# EAGLE design schematic_mod (EAGLE 7.3.0)
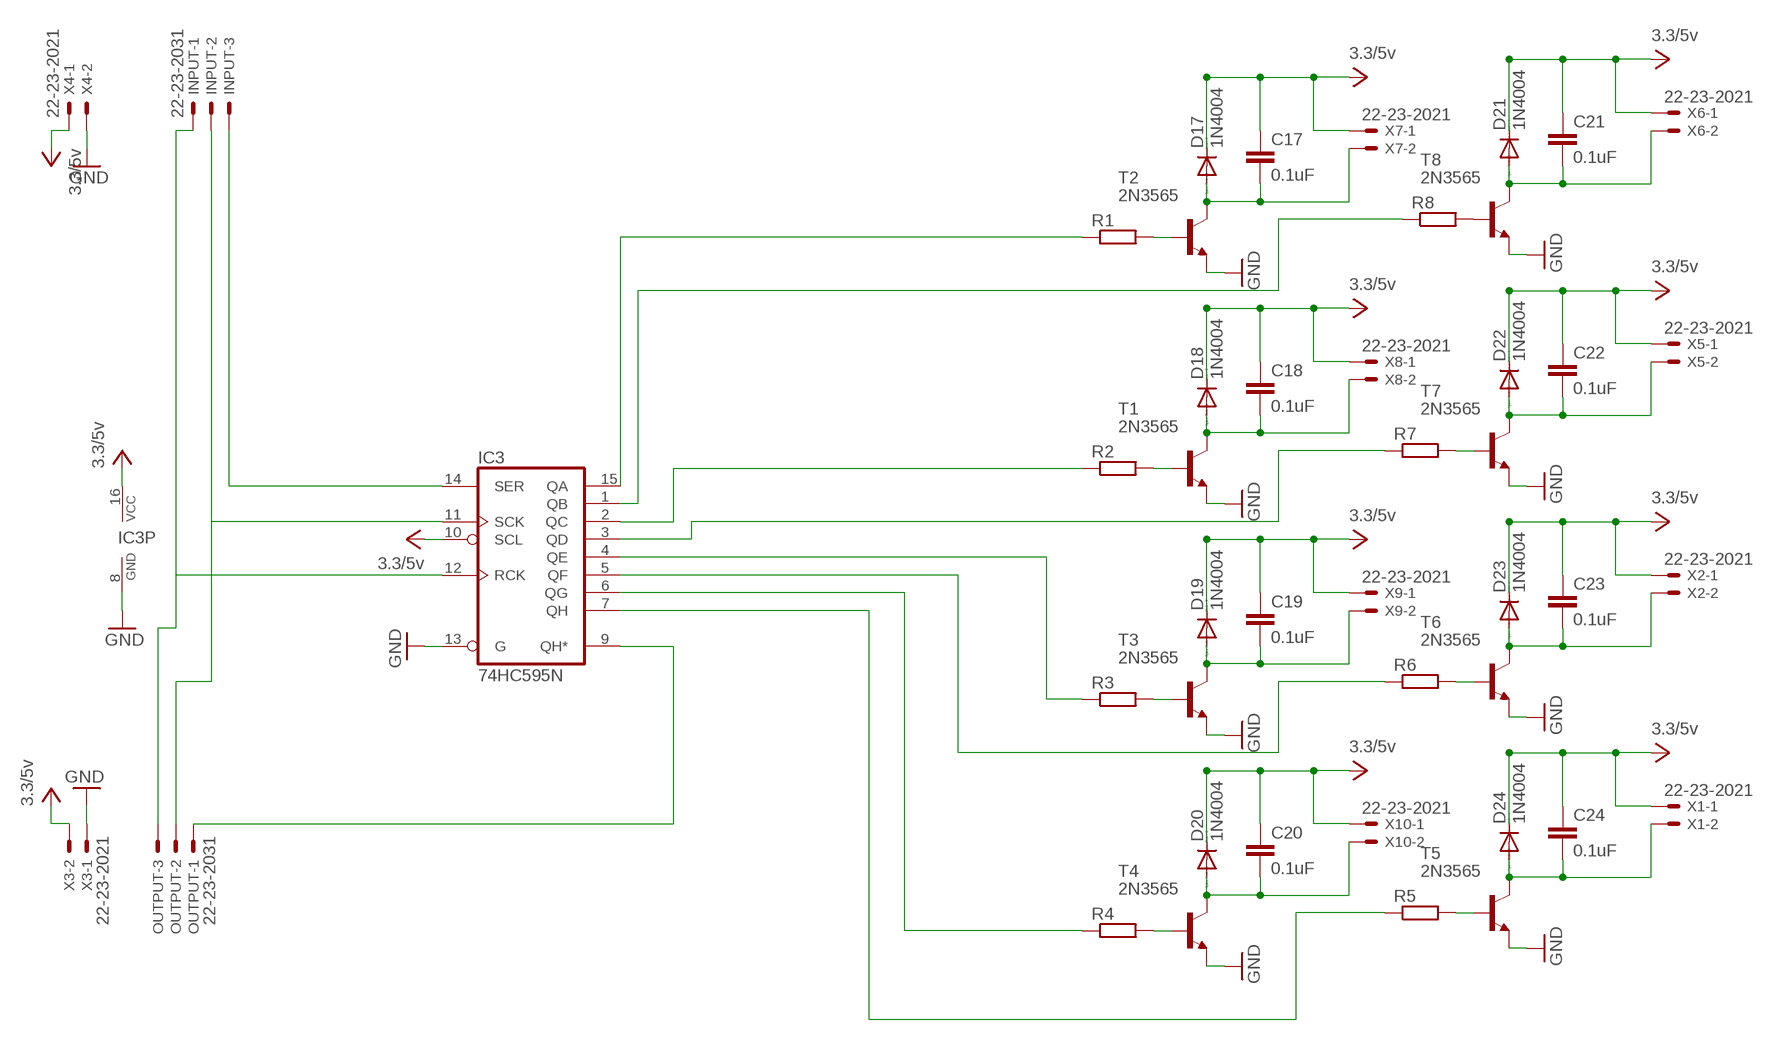
[diagram p0: schematic, sheet 1]

## Parts
C17  0.1uF  C-EU025-024X044  [C025-024X044]
C18  0.1uF  C-EU025-024X044  [C025-024X044]
C19  0.1uF  C-EU025-024X044  [C025-024X044]
C20  0.1uF  C-EU025-024X044  [C025-024X044]
C21  0.1uF  C-EU025-024X044  [C025-024X044]
C22  0.1uF  C-EU025-024X044  [C025-024X044]
C23  0.1uF  C-EU025-024X044  [C025-024X044]
C24  0.1uF  C-EU025-024X044  [C025-024X044]
D17  1N4004  [DO41-10]
D18  1N4004  [DO41-10]
D19  1N4004  [DO41-10]
D20  1N4004  [DO41-10]
D21  1N4004  [DO41-10]
D22  1N4004  [DO41-10]
D23  1N4004  [DO41-10]
D24  1N4004  [DO41-10]
IC3  74HC595N  [DIL16]
INPUT  22-23-2031  [22-23-2031]
OUTPUT  22-23-2031  [22-23-2031]
R1  R-EU_0207/7  [0207/7]
R2  R-EU_0207/7  [0207/7]
R3  R-EU_0207/7  [0207/7]
R4  R-EU_0207/7  [0207/7]
R5  R-EU_0207/7  [0207/7]
R6  R-EU_0207/7  [0207/7]
R7  R-EU_0207/7  [0207/7]
R8  R-EU_0207/7  [0207/7]
T1  2N3565  [TO92]
T2  2N3565  [TO92]
T3  2N3565  [TO92]
T4  2N3565  [TO92]
T5  2N3565  [TO92]
T6  2N3565  [TO92]
T7  2N3565  [TO92]
T8  2N3565  [TO92]
X1  22-23-2021  [22-23-2021]
X2  22-23-2021  [22-23-2021]
X3  22-23-2021  [22-23-2021]
X4  22-23-2021  [22-23-2021]
X5  22-23-2021  [22-23-2021]
X6  22-23-2021  [22-23-2021]
X7  22-23-2021  [22-23-2021]
X8  22-23-2021  [22-23-2021]
X9  22-23-2021  [22-23-2021]
X10  22-23-2021  [22-23-2021]

## Nets
GND: IC3.8(GND) IC3.13(G) T1.3(E) T2.3(E) T3.3(E) T4.3(E) T5.3(E) T6.3(E) T7.3(E) T8.3(E) X3.1 X4.2
N$1: R8.2 T8.2(B)
N$54: C17.2 D17.A T2.1(C) X7.2
N$55: R1.2 T2.2(B)
N$57: C18.2 D18.A T1.1(C) X8.2
N$58: R2.2 T1.2(B)
N$59: C19.2 D19.A T3.1(C) X9.2
N$60: R3.2 T3.2(B)
N$61: C20.2 D20.A T4.1(C) X10.2
N$62: R4.2 T4.2(B)
N$63: C21.2 D21.A T8.1(C) X6.2
N$65: C22.2 D22.A T7.1(C) X5.2
N$66: R7.2 T7.2(B)
N$67: C23.2 D23.A T6.1(C) X2.2
N$68: R6.2 T6.2(B)
N$69: C24.2 D24.A T5.1(C) X1.2
N$70: R5.2 T5.2(B)
N$71: IC3.15(QA) R1.1
N$72: IC3.1(QB) R8.1
N$73: IC3.2(QC) R2.1
N$74: IC3.3(QD) R7.1
N$75: IC3.4(QE) R3.1
N$76: IC3.5(QF) R6.1
N$77: IC3.6(QG) R4.1
N$78: IC3.7(QH) R5.1
N$79: IC3.14(SER) INPUT.3
N$106: IC3.9(QH*) OUTPUT.1
N$180: IC3.11(SCK) INPUT.2 OUTPUT.2
N$181: IC3.12(RCK) INPUT.1 OUTPUT.3
VCC: C17.1 C18.1 C19.1 C20.1 C21.1 C22.1 C23.1 C24.1 D17.C D18.C D19.C D20.C D21.C D22.C D23.C D24.C IC3.10(SCL) IC3.16(VCC) X1.1 X2.1 X3.2 X4.1 X5.1 X6.1 X7.1 X8.1 X9.1 X10.1 ; supply symbol labelled 3.3/5v

## Library data of the parts
C17-C24 = resistor:C-EU: CAPACITOR, European symbol
D17-D24 = diode:1N4004: DIODE general purpose rectifier, 1 A
IC3 = 74xx-eu:74*595: 8-bit SHIFT REGISTER, output latch
INPUT OUTPUT = con-molex:22-23-2031: .100" (2.54mm) Center Header - 3 Pin; MF: MOLEX; MPN: 22-23-2031; OC_FARNELL: 1462950; OC_NEWARK: 30C0862
R1-R8 = rcl:R-EU_: RESISTOR, European symbol
T1-T8 = transistor:2N3565: NPN TRANSISTOR
X1-X10 = con-molex:22-23-2021: .100" (2.54mm) Center Header - 2 Pin; MF: MOLEX; MPN: 22-23-2021; OC_FARNELL: 1462926; OC_NEWARK: 25C3832

## Board
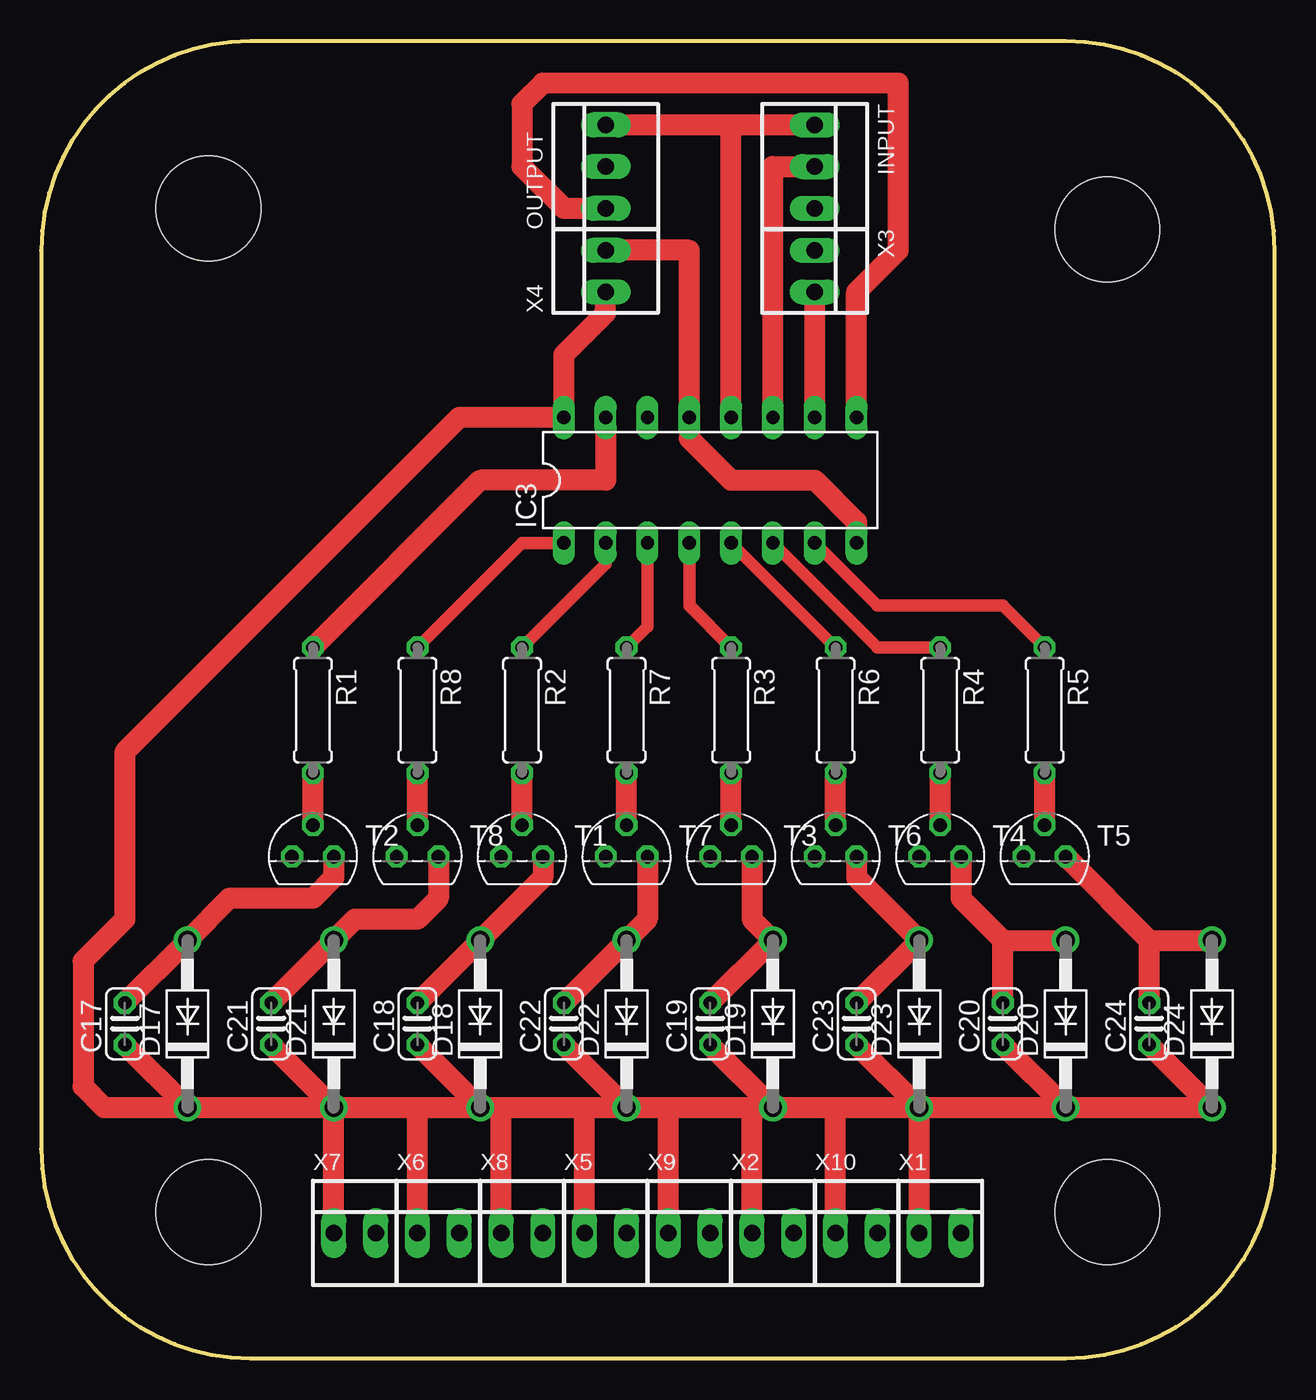
[diagram p1: board, top side]
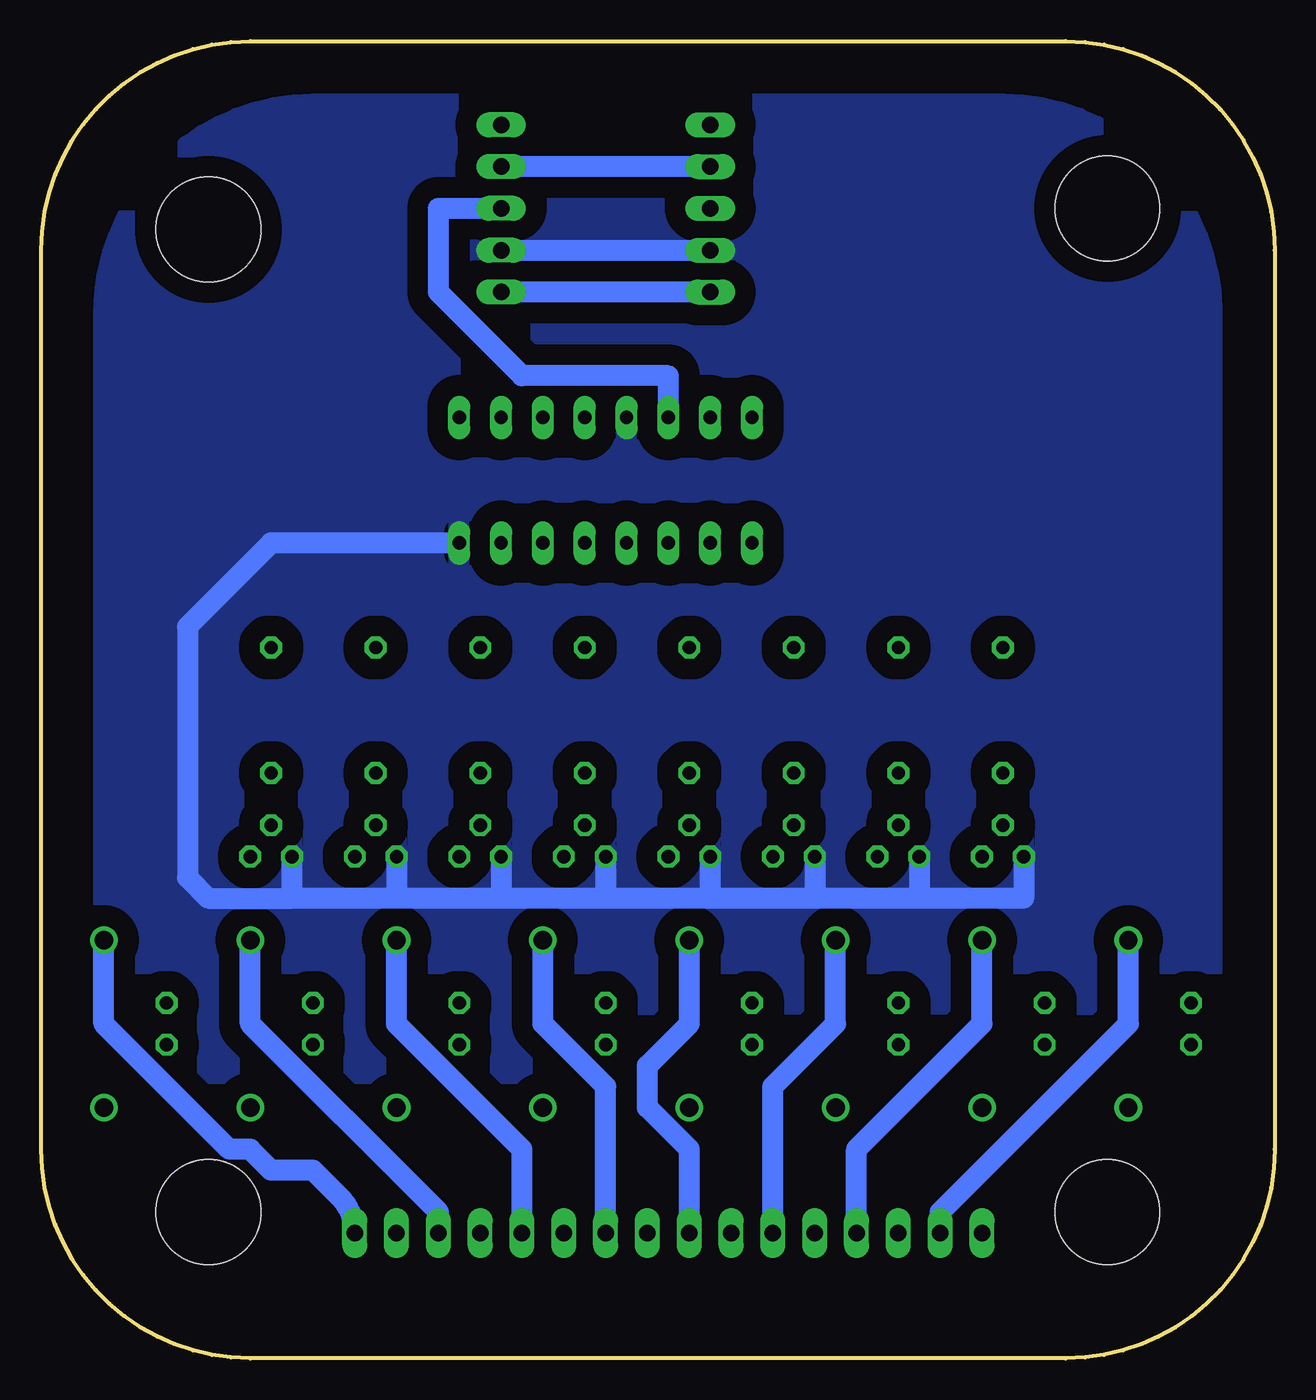
[diagram p2: board, bottom side, seen from below]

Size 74.93 x 80.01 mm. Coordinates in mm from the lower left corner, seen from the top.
Outline: 0,67.31 0,12.7 arc90 12.7,0 62.23,0 arc90 74.93,12.7 74.93,67.31 arc90 62.23,80.01 12.7,80.01 arc90 0,67.31
Copper layers (1*16): Top 0.035mm / dielectric 1.5mm / Bottom 0.035mm
Design rules "default": minimum track width 10mil, minimum drill 24mil, track to track 8mil, track to pad 8mil, pad to pad 8mil, via to via 8mil, smd to smd 8mil, copper to edge 40mil, drill to drill 8mil, minimum pad ring 10mil, minimum via ring 8mil, stop-mask expansion 4mil, vias tented up to drill 0mil, thermal gap 10mil
Holes 6.35 mm at 10.16,69.85 64.77,68.58 10.16,8.89 64.77,8.89

### Footprints (pad centres in the part's own frame; a part is rotated, then mirrored left to right if it is on the bottom)
C025-024X044 = drill 0.813 octagon: 1 -1.27,0; 2 1.27,0
DO41-10 = drill 1.118: A 5.08,0; C -5.08,0
DIL16 = drill 0.813 long: 1 -8.89,-3.81; 2 -6.35,-3.81; 3 -3.81,-3.81; 4 -1.27,-3.81; 5 1.27,-3.81; 6 3.81,-3.81; 7 6.35,-3.81; 8 8.89,-3.81; 9 8.89,3.81; 10 6.35,3.81; 11 3.81,3.81; 12 1.27,3.81; 13 -1.27,3.81; 14 -3.81,3.81; 15 -6.35,3.81; 16 -8.89,3.81
22-23-2031 = drill 1 long: 1 -2.54,0; 2 0,0; 3 2.54,0
0207/7 = drill 0.813 octagon: 1 -3.81,0; 2 3.81,0
TO92 = drill 0.813 octagon: 1 1.27,0; 2 0,1.905; 3 -1.27,0
22-23-2021 = drill 1 long: 1 -1.27,0; 2 1.27,0

### Placement (x,y rotation side)
C17  5.08,20.32 90 top
C18  22.86,20.32 90 top
C19  40.64,20.32 90 top
C20  58.42,20.32 90 top
C21  13.97,20.32 90 top
C22  31.75,20.32 90 top
C23  49.53,20.32 90 top
C24  67.31,20.32 90 top
D17  8.89,20.32 90 top
D18  26.67,20.32 90 top
D19  44.45,20.32 90 top
D20  62.23,20.32 90 top
D21  17.78,20.32 90 top
D22  35.56,20.32 90 top
D23  53.34,20.32 90 top
D24  71.12,20.32 90 top
IC3  40.64,53.34 0 top
INPUT  46.99,72.39 270 top
OUTPUT  34.29,72.39 90 top
R1  16.51,39.37 270 top
R2  29.21,39.37 270 top
R3  41.91,39.37 270 top
R4  54.61,39.37 270 top
R5  60.96,39.37 270 top
R6  48.26,39.37 270 top
R7  35.56,39.37 270 top
R8  22.86,39.37 270 top
T1  29.21,30.48 0 top
T2  16.51,30.48 0 top
T3  41.91,30.48 0 top
T4  54.61,30.48 0 top
T5  60.96,30.48 0 top
T6  48.26,30.48 0 top
T7  35.56,30.48 0 top
T8  22.86,30.48 0 top
X1  54.61,7.62 0 top
X2  44.45,7.62 0 top
X3  46.99,66.04 270 top
X4  34.29,66.04 90 top
X5  34.29,7.62 0 top
X6  24.13,7.62 0 top
X7  19.05,7.62 0 top
X8  29.21,7.62 0 top
X9  39.37,7.62 0 top
X10  49.53,7.62 0 top

### Tracks (layer width: path | path; a pad name or v marks a point on that pad's centre or on a via)
GND
  Top 1.27: IC3.8 49.53,50.8 46.99,53.34 41.91,53.34 39.37,55.88 IC3.13 39.37,67.31 X4.2
  Bottom 1.27: X3.1 X4.2 | T2.3 15.24,27.94 21.59,27.94 | 21.59,27.94 27.94,27.94 | 27.94,27.94 34.29,27.94 | 34.29,27.94 40.64,27.94 | 40.64,27.94 46.99,27.94 | 46.99,27.94 53.34,27.94 | 53.34,27.94 59.69,27.94 | 59.69,27.94 T5.3 | T4.3 53.34,27.94 | T6.3 46.99,27.94 | T3.3 40.64,27.94 | T7.3 34.29,27.94 | T1.3 27.94,27.94 | T8.3 21.59,27.94 | IC3.8 60.96,49.53 66.04,44.45 66.04,29.21 64.77,27.94 59.69,27.94
  pour Bottom (isolate 1.27): 71.12,16.51 71.12,63.5 arc90 58.42,76.2 16.51,76.2 arc90 3.81,63.5 3.81,16.51 arc90 16.51,3.81 58.42,3.81 arc90
N$1
  Top 1.27: T8.2 R8.2
N$54
  Top 1.27: T2.1 17.78,29.21 16.51,27.94 11.43,27.94 D17.A C17.2
  Bottom 1.27: X7.2 20.32,8.89 8.89,20.32 D17.A
N$55
  Top 1.27: T2.2 R1.2
N$57
  Top 1.27: T1.1 30.48,29.21 D18.A C18.2
  Bottom 1.27: X8.2 30.48,16.51 26.67,20.32 D18.A
N$58
  Top 1.27: T1.2 R2.2
N$59
  Top 1.27: T3.1 43.18,26.67 D19.A C19.2
  Bottom 1.27: X9.2 40.64,16.51 44.45,20.32 D19.A
N$60
  Top 1.27: T3.2 R3.2
N$61
  Top 1.27: T4.1 55.88,27.94 58.42,25.4 | 58.42,25.4 D20.A | C20.2 58.42,25.4
  Bottom 1.27: X10.2 50.8,8.89 62.23,20.32 D20.A
N$62
  Top 1.27: T4.2 R4.2
N$63
  Top 1.27: T8.1 24.13,27.94 22.86,26.67 19.05,26.67 D21.A C21.2
  Bottom 1.27: X6.2 25.4,12.7 17.78,20.32 D21.A
N$65
  Top 1.27: T7.1 36.83,26.67 D22.A C22.2
  Bottom 1.27: X5.2 35.56,12.7 38.1,15.24 38.1,17.78 35.56,20.32 D22.A
N$66
  Top 1.27: T7.2 R7.2
N$67
  Top 1.27: T6.1 49.53,29.21 D23.A C23.2
  Bottom 1.27: X2.2 45.72,12.7 53.34,20.32 D23.A
N$68
  Top 1.27: T6.2 R6.2
N$69
  Top 1.27: T5.1 67.31,25.4 | 67.31,25.4 D24.A | C24.2 67.31,25.4
  Bottom 1.27: X1.2 arc-45 56.78,9.79 58.42,11.43 60.96,11.43 62.23,12.7 63.5,12.7 71.12,20.32 D24.A
N$70
  Top 1.27: T5.2 R5.2
N$71
  Top 1.27: IC3.15 34.29,53.34 26.67,53.34 R1.1
N$72
  Top 0.762: R8.1 29.21,49.53 IC3.1
N$73
  Top 0.762: R2.1 34.29,48.26 IC3.2
N$74
  Top 0.762: R7.1 36.83,44.45 IC3.3
N$75
  Top 0.762: R3.1 39.37,45.72 IC3.4
N$76
  Top 0.762: R6.1 IC3.5
N$77
  Top 0.762: R4.1 50.8,43.18 IC3.6
N$78
  Top 0.762: R5.1 58.42,45.72 50.8,45.72 IC3.7
N$79
  Bottom 1.27: IC3.14 36.83,59.69 45.72,59.69 50.8,64.77 50.8,69.85 INPUT.3
N$106
  Top 1.27: IC3.9 49.53,64.77 52.07,67.31 52.07,77.47 30.48,77.47 29.21,76.2 29.21,72.39 31.75,69.85 OUTPUT.1
N$180
  Top 1.27: IC3.11 44.45,72.39 INPUT.2
  Bottom 1.27: OUTPUT.2 INPUT.2
N$181
  Top 1.27: OUTPUT.3 41.91,74.93 | 41.91,74.93 INPUT.1 | IC3.12 41.91,74.93
VCC
  Top 1.27: X4.1 34.29,63.5 31.75,60.96 IC3.16 25.4,57.15 5.08,36.83 5.08,26.67 2.54,24.13 2.54,16.51 3.81,15.24 D17.C | D17.C C17.1 | C21.1 D21.C | C18.1 D18.C | C22.1 D22.C | C19.1 D19.C | D23.C C23.1 | D20.C C20.1 | C24.1 D24.C D20.C | D17.C D21.C | D21.C 22.86,15.24 | 22.86,15.24 D18.C | D18.C 27.94,15.24 | 27.94,15.24 33.02,15.24 | 33.02,15.24 D22.C | D22.C 38.1,15.24 | 38.1,15.24 43.18,15.24 | 43.18,15.24 D19.C | D19.C 48.26,15.24 | 48.26,15.24 D23.C | D23.C D20.C | X1.1 D23.C | X10.1 48.26,15.24 | X2.1 43.18,15.24 | X9.1 38.1,15.24 | X5.1 33.02,15.24 | X8.1 27.94,15.24 | X6.1 22.86,15.24 | X7.1 D21.C | IC3.10 X3.2
  Bottom 1.27: X4.1 X3.2